# EasyEDA Pro project ProPrj_辉光管时钟V2.0_2025-10-09.epro, schematic 电源+控制部分

## Sheets
1 控制: Board Name: 电源+控制部分; Create Date: 2024-09-08; Page Name: 控制; Project Name: 辉光管时钟V2.0; Schematic Name: 电源+控制部分; Update Date: 2024-09-17
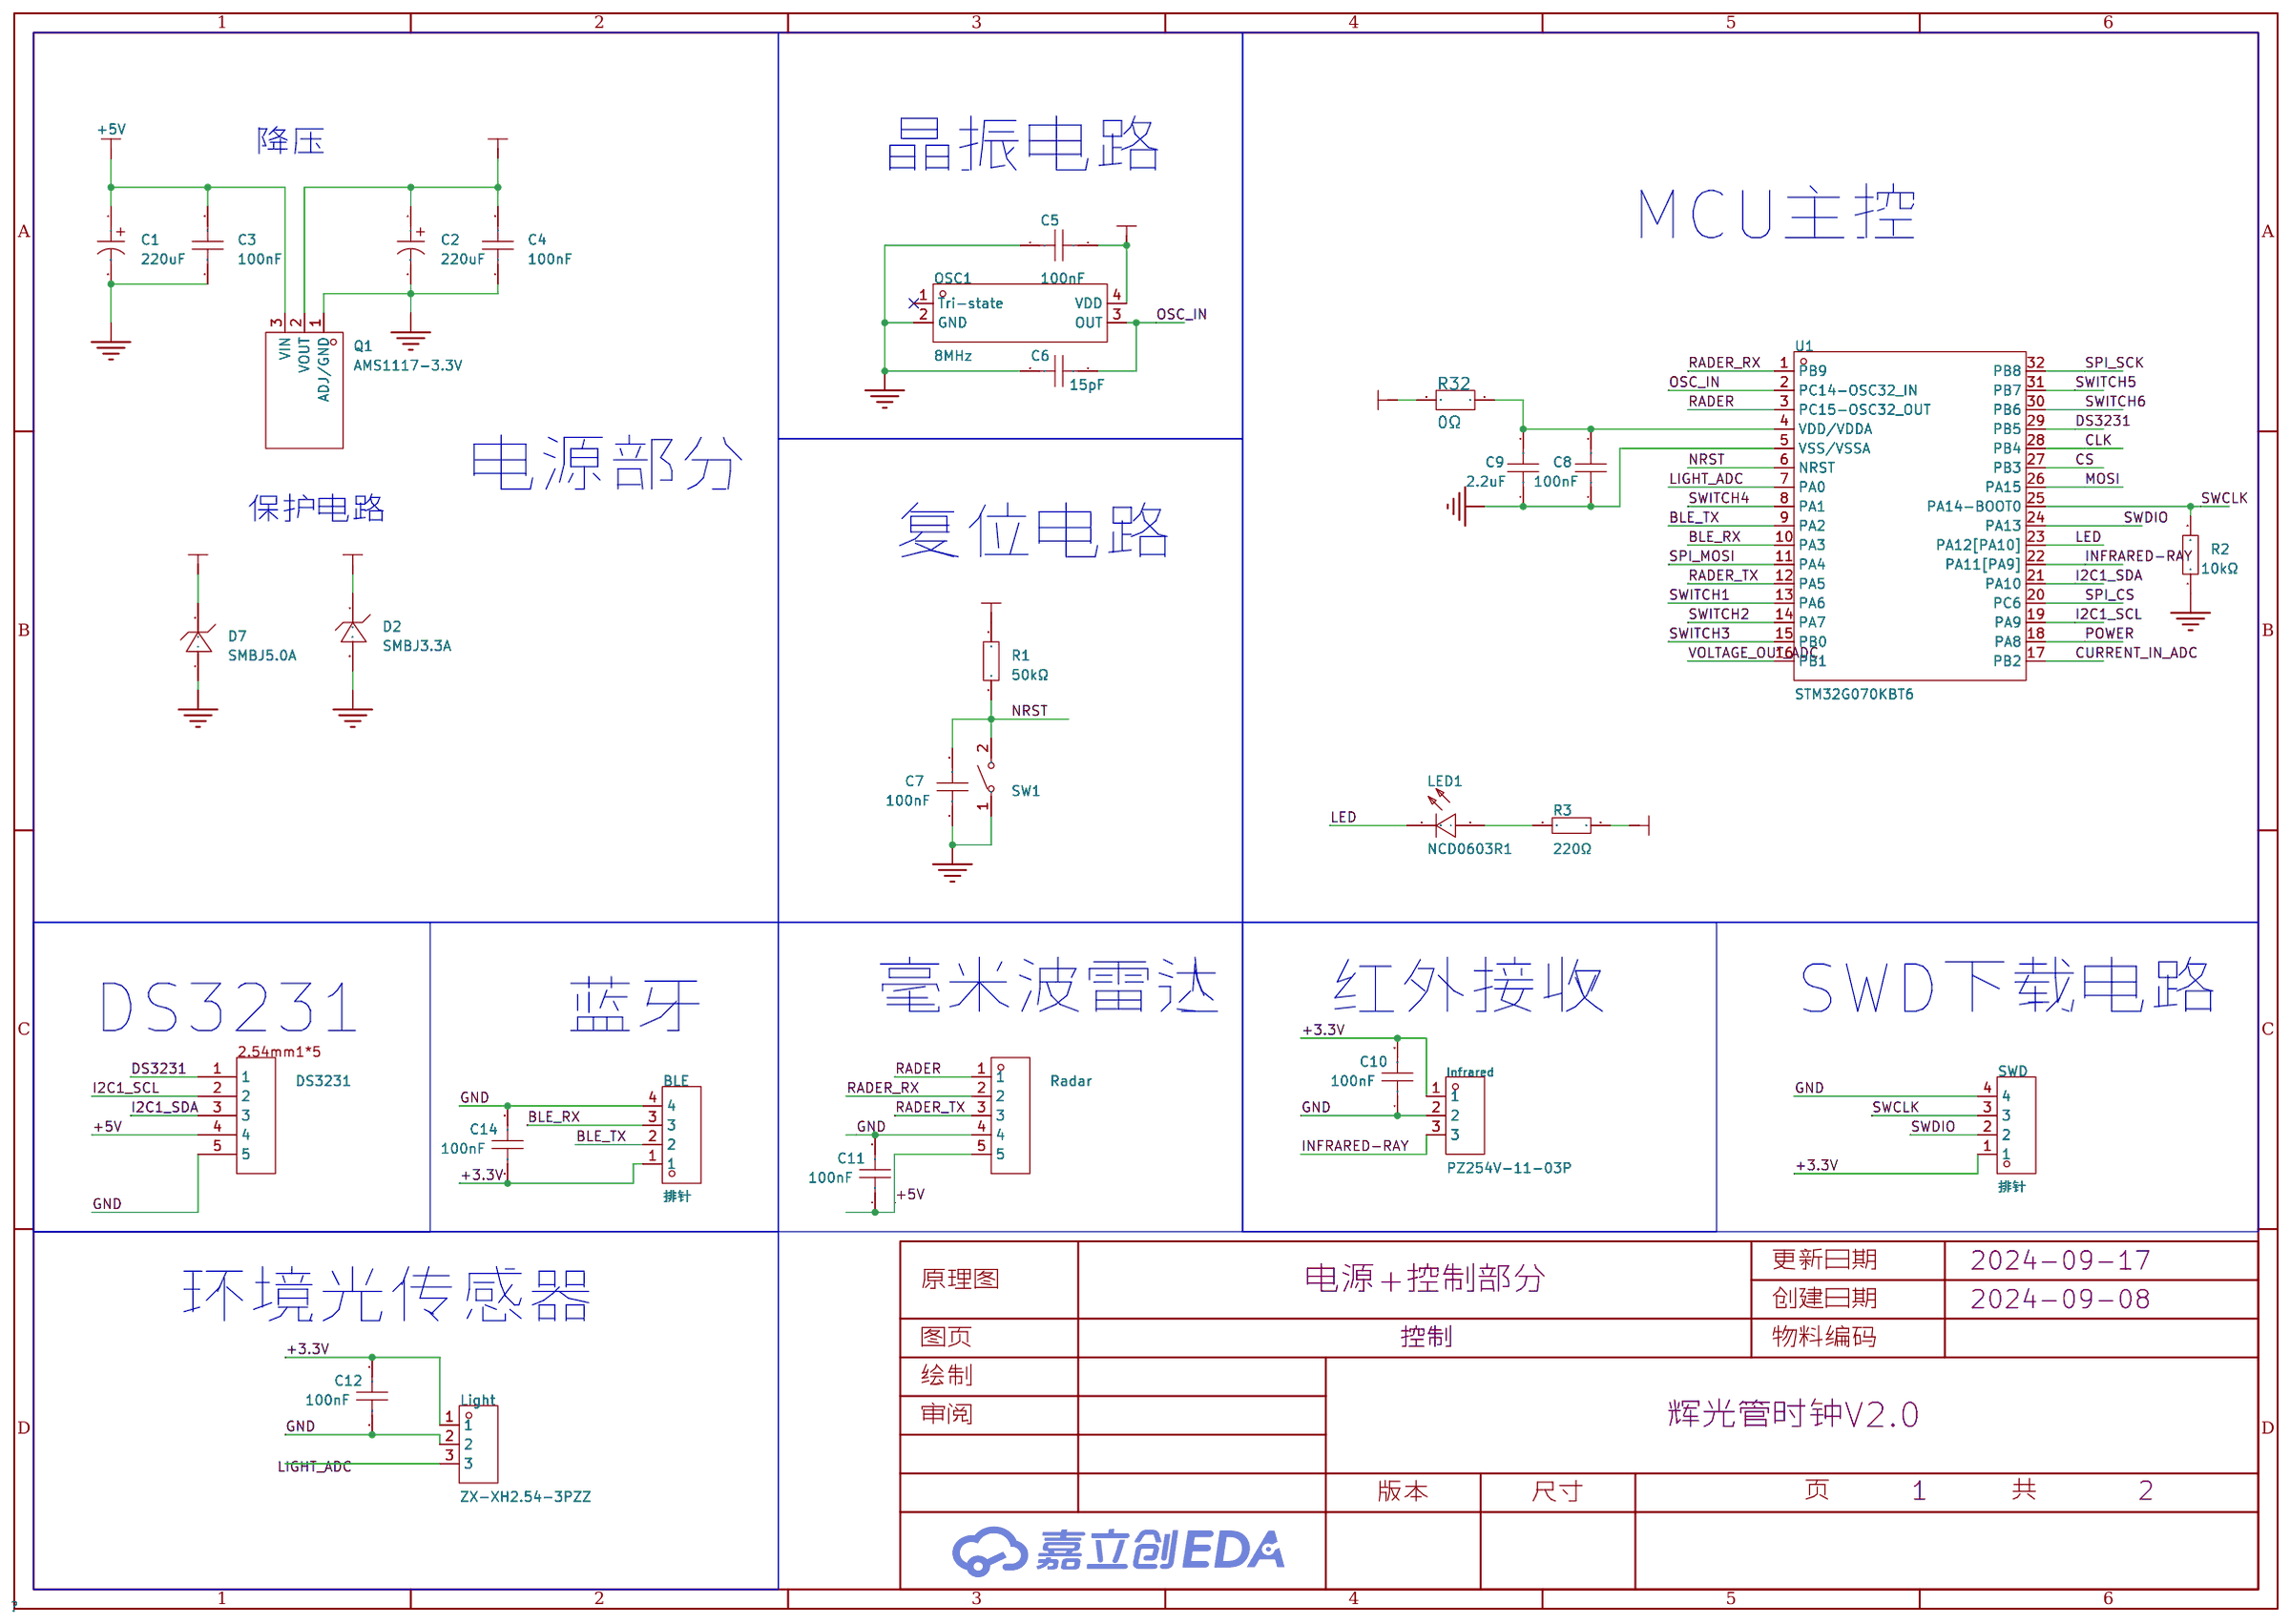
[diagram p1: 控制]
2 电源: Page Name: 电源; Update Date: 2024-09-19; Company: 嘉立创EDA; Page Size: A3; Version: V1.0
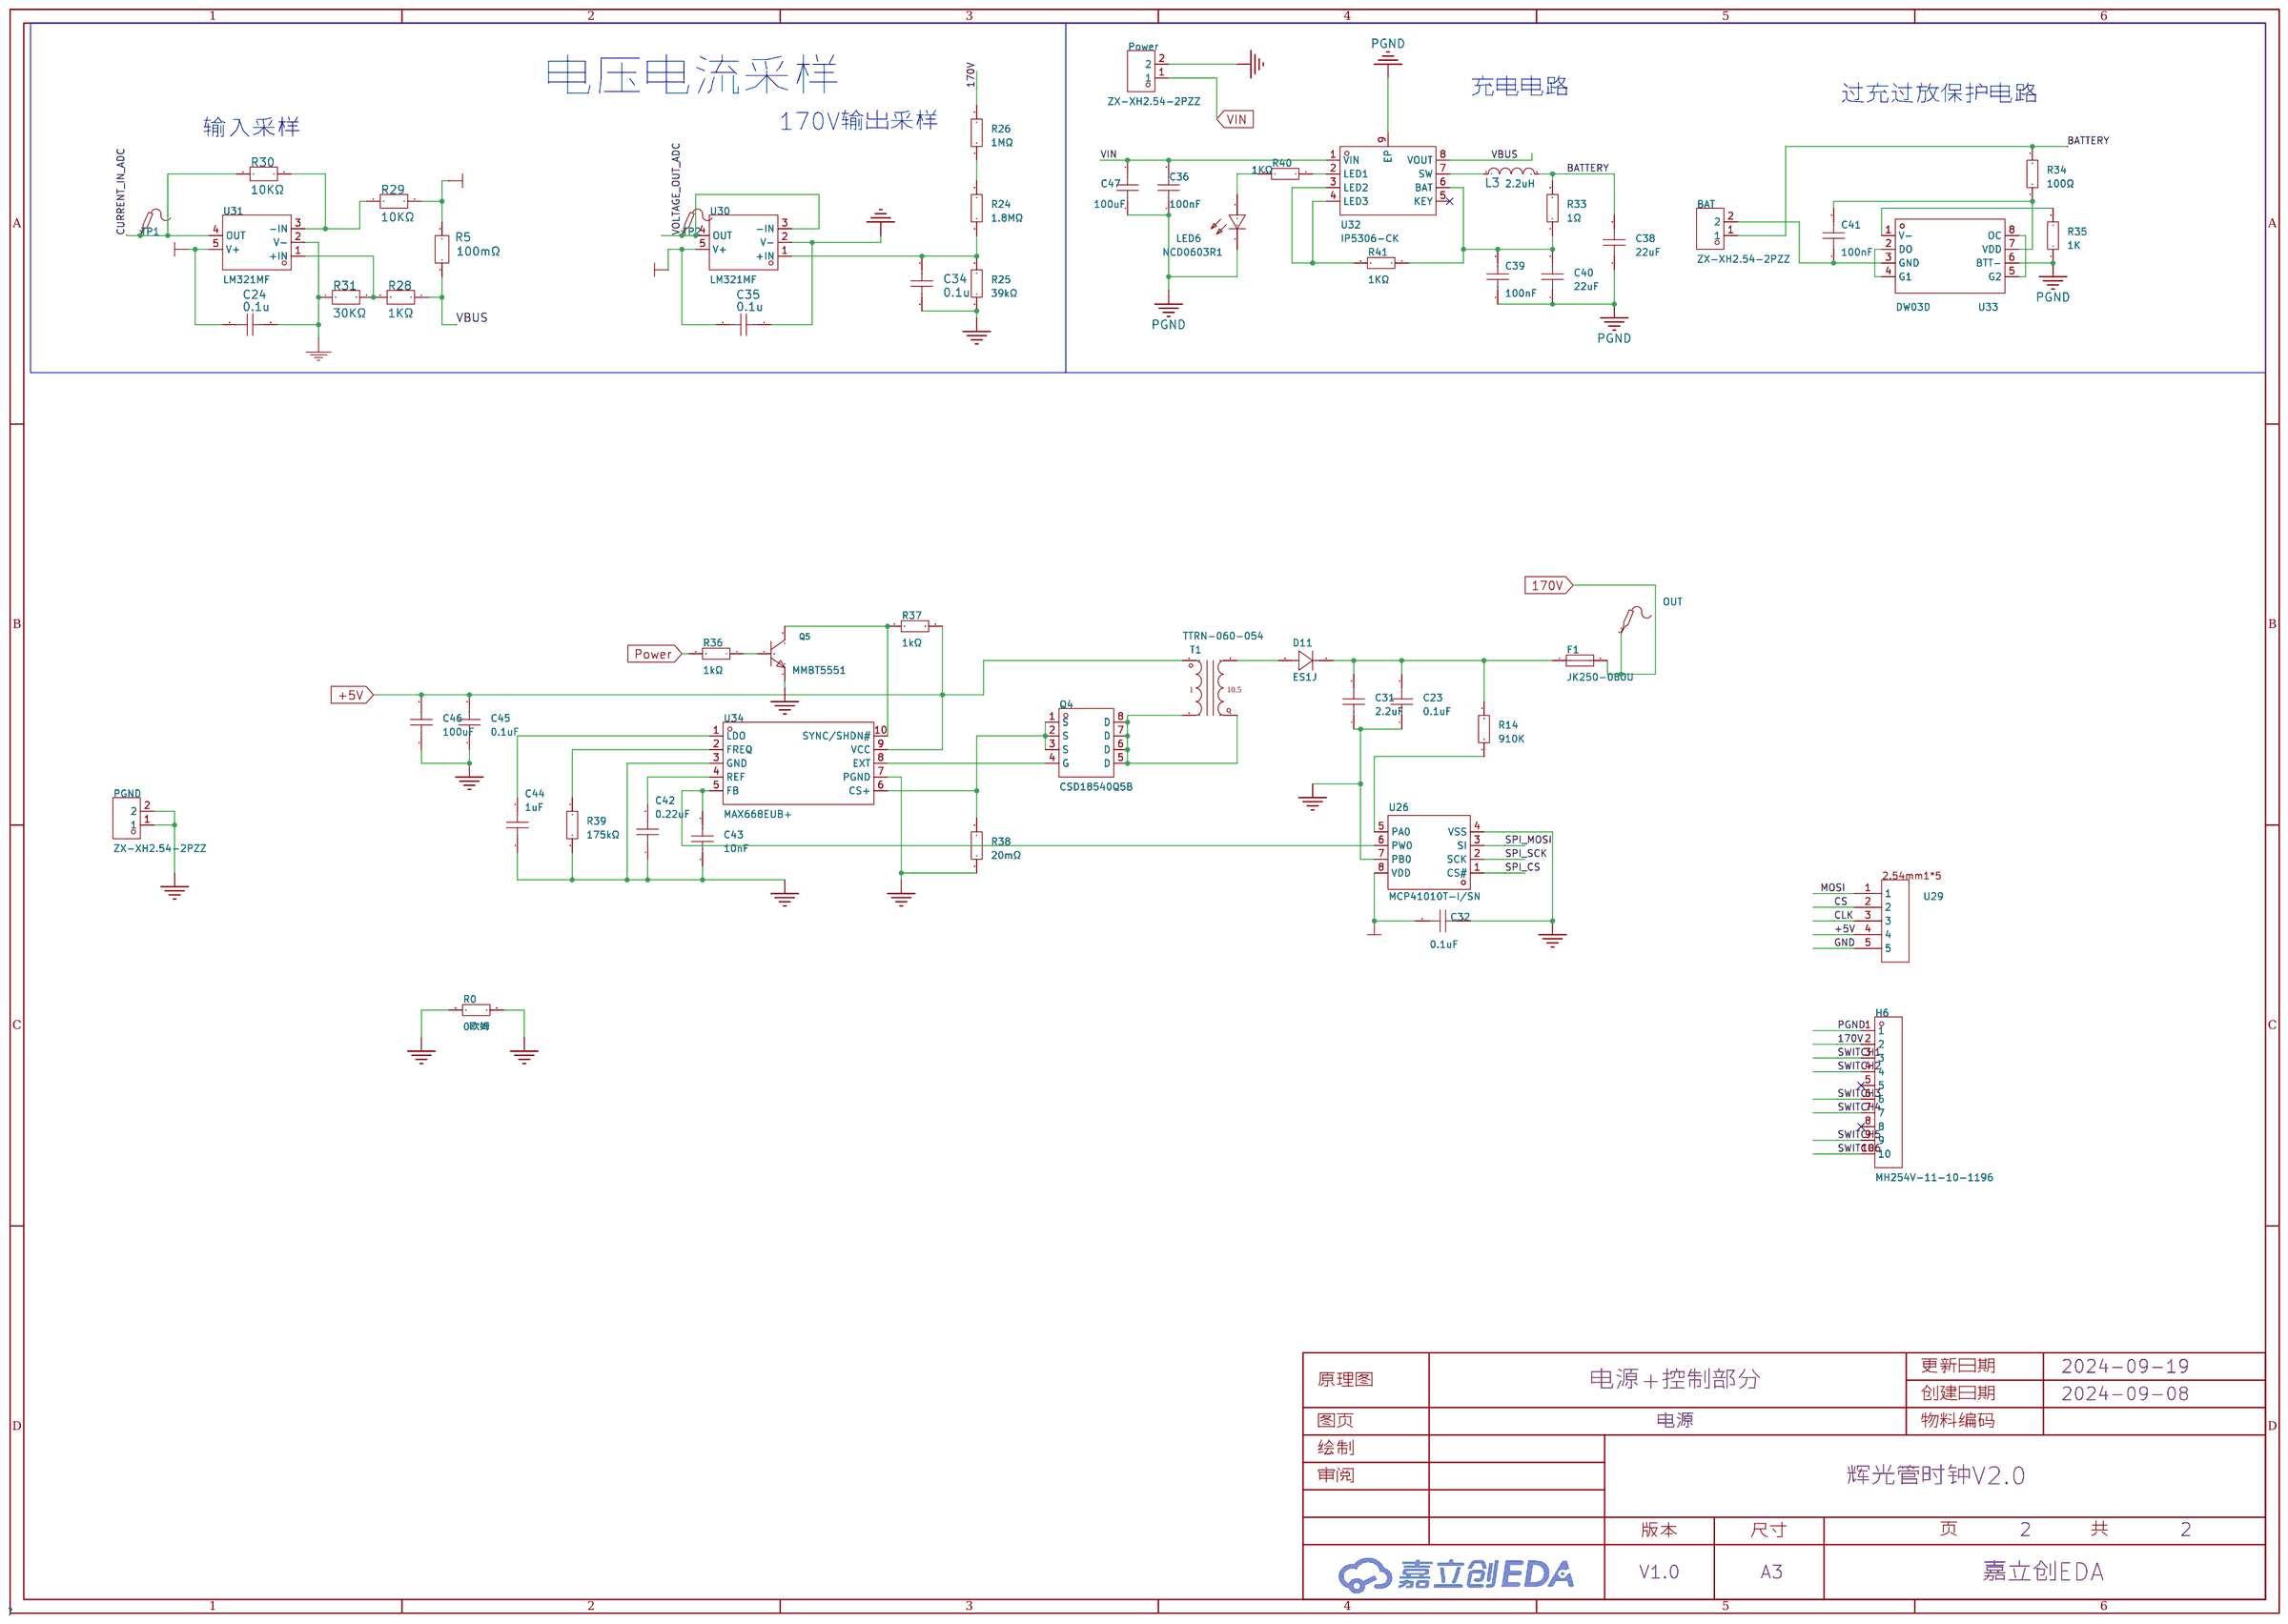
[diagram p2: 电源]

## Parts
sheet 控制
BLE  排针  [SIP-2.54MM-4P-CJT-H8.54]
C1  220uF  [CAP-SMD_BD6.3-L6.6-W6.6-FD]
C2  220uF  [CAP-SMD_BD6.3-L6.6-W6.6-FD]
C3  100nF  [C0603]
C4  100nF  [C0603]
C5  100nF  [C0603]
C6  15pF  [C0603]
C7  100nF  [C0603]
C8  100nF  [C0603]
C9  2.2uF  [C0603]
C10  100nF  [C0603]
C11  100nF  [C0603]
C12  100nF  [C0603]
C14  100nF  [C0603]
D2  SMBJ3.3A  [SMB_L4.6-W3.6-LS5.3-RD]
D7  SMBJ5.0A  [SMB_L4.4-W3.6-LS5.3-RD]
DS3231  -  [2.54mm1*5]
Infrared  PZ254V-11-03P  [HDR-TH_3P-P2.54-V-M]
LED1  NCD0603R1  [LED0603-RD_RED]
Light  ZX-XH2.54-3PZZ  [CONN-TH_3P-P2.54_2501S-3P]
OSC1  8MHz  [OSC-SMD_4P-L3.2-W2.5-BL-1]
Q1  AMS1117-3.3V  [SOT-89-3_L4.5-W2.5-P1.50-LS4.2-BR]
R1  50kΩ  [r0603]
R2  10kΩ  [r0603]
R3  220Ω  [r0603]
R32  0Ω  [R0603]
Radar  FH1.27-01-5PZD  [HDR-TH_5P-P1.27-V-M]
SW1  TS-1088R-02026  [SW-SMD_L3.9-W3.0-P4.45]
SWD  排针  [SIP-2.54MM-4P-CJT-H8.54]
U1  STM32G070KBT6  [LQFP-32_L7.0-W7.0-P0.80-LS9.0-BL]
sheet 电源
BAT  ZX-XH2.54-2PZZ  [CONN-TH_2P-P2.50_HX25003-2A]
C23  0.1uF  [c1206]
C24  0.1u  [C0603]
C31  2.2uF  [c1210]
C32  0.1uF  [c0603]
C34  0.1u  [C0603]
C35  0.1u  [C0603]
C36  100nF  [C0603]
C38  22uF  [c1206]
C39  100nF  [C0603]
C40  22uF  [c1206]
C41  100nF  [C0603]
C42  0.22uF  [c0603]
C43  10nF  [c0603]
C44  1uF  [c0603]
C45  0.1uF  [c0603]
C46  100uF  [c1206]
C47  100uF  [c1206]
D11  ES1J  [sod-123_l2.7-w1.6-ls3.6-rd]
F1  JK250-080U  [FUSE-TH_L5.8-W3.8-P5.10-D0.8]
H6  MH254V-11-10-1196  [HDR-TH_10P-P2.54-V-M]
L3  2.2uH  [IND-SMD_L7.0-W6.6]
LED6  NCD0603R1  [LED0603-RD_RED]
OUT  -  [Test-Point-0.5mm]
PGND  ZX-XH2.54-2PZZ  [CONN-TH_2P-P2.50_HX25003-2A]
Power  ZX-XH2.54-2PZZ  [CONN-TH_2P-P2.50_HX25003-2A]
Q4  CSD18540Q5B  [VSON-CLIP-8_L5.0-W6.0-P1.27-BL]
Q5  MMBT5551  [SOT-23-3_L2.9-W1.3-P1.90-LS2.4-BR]
R0  0欧姆  [R0603]
R5  100mΩ  [R0805]
R14  910K  [r0603]
R24  1.8MΩ  [r0603]
R25  39kΩ  [r0603]
R26  1MΩ  [r0603]
R28  1KΩ  [R0603]
R29  10KΩ  [R0603]
R30  10KΩ  [R0603]
R31  30KΩ  [R0603]
R33  1Ω  [R0603]
R34  100Ω  [R0603]
R35  1K  [R0603]
R36  1kΩ  [r0603]
R37  1kΩ  [r0603]
R38  20mΩ  [R0805]
R39  175kΩ  [r0603]
R40  1KΩ  [R0603]
R41  1KΩ  [R0603]
T1  TTRN-060-054  [TTRN-060-054]
TP1  -  [Test-Point-0.5mm]
TP2  -  [Test-Point-0.5mm]
U26  MCP41010T-I/SN  [SOIC-8_L4.9-W3.9-P1.27-LS6.0-BL]
U29  -  [2.54mm1*5]
U30  LM321MF  [SOT-23-5_L2.9-W1.6-P0.95-LS2.8-BL]
U31  LM321MF  [SOT-23-5_L2.9-W1.6-P0.95-LS2.8-BL]
U32  IP5306-CK  [SOP-8_L4.9-W3.9-P1.27-LS6.0-BL-EP2.1]
U33  DW03D  [TSSOP-8_L4.4-W3.0-P0.65-LS6.4-BL]
U34  MAX668EUB+  [UMAX-10_L3.0-W3.0-P0.50-LS4.9-BL]

## Library data of the parts
BLE SWD = 排针
C1 C2 = RVT220UF10V67RV0037: 容值:220uF;精度:±20%;额定电压:10V;纹波电流:69mA@120Hz;等效串联电阻:-;; LCSC Part Name: 220uF ±20% 10V; Supplier Part: C2833309; Manufacturer: KNSCHA(科尼盛); Supplier Footprint: SMD,D6.3xL5.4mm; JLCPCB Part Class: Extended Part; Datasheet: https://atta.szlcsc.com/upload/public/pdf/source/20210521/C2833309_008BCE4BC4FC60DA08096FEE6338ABBD.pdf; Supplier: LCSC; Tolerance: ±20%; Rated Voltage: 10V; Ripple Current: 69mA@120Hz; φD: 6.3mm; L: 5.4mm; Lifetime @ Temp: 2000hrs@105℃; Operating Temperature: -55℃~+105℃
C3-C12 C14 = CC0603KRX7R9BB104: 容值:100nF;精度:±10%;额定电压:50V;材质(温度系数):X7R;; LCSC Part Name: 100nF ±10% 50V; Supplier Part: C14663; Manufacturer: YAGEO(国巨); Supplier Footprint: 0603; JLCPCB Part Class: Basic Part; Datasheet: https://atta.szlcsc.com/upload/public/pdf/source/20180910/C282072_33301C7F631E79921B82A8DAC6BCC5B3.pdf; Supplier: LCSC; Tolerance: ±10%; Voltage Rated: 50V; Temperature Coefficient: X7R
D2 = SMBJ3.3A_C362089: 反向截止电压(Vrwm):3.3V;击穿电压:4.1V;最大钳位电压:7.3V;; LCSC Part Name: 单向TVS 3.3V截止 600W峰值脉冲功率; Supplier Part: C362089; Manufacturer: JKSEMI(金开盛); Supplier Footprint: SMB(DO-214AA); JLCPCB Part Class: Extended Part; Datasheet: https://atta.szlcsc.com/upload/public/pdf/source/20200731/C362089_3B984BF84356FE4A5051ADB3F5B1E766.pdf; Supplier: LCSC; Unidirectional Channels: 1; Bidirectional Channels: 0; Reverse Stand-Off Voltage (Vrwm): 3.3V; Breakdown Voltage: 4.1V; Maximum Clamping Voltage: 7.3V; Peak Pulse Power Dissipation (Ppp)@10/1000us: 600W
D7 = SMBJ5.0A_C726811: 极性：单向 反向截止电压(Vrwm)：5V 击穿电压：6.4V 最大钳位电压：9.2V; Supplier Part: C726811; Manufacturer: TWGMC(台湾迪嘉); Supplier Footprint: SMB; JLCPCB Part Class: Extended Part; Datasheet: https://atta.szlcsc.com/upload/public/pdf/source/20200901/C726811_07201DC3516E92FF13903A0BAE18F725.pdf; Supplier: LCSC
DS3231 U29 = 2.54mm1*5
Infrared = PZ254V-11-03P: 排数:单排;总PIN位数:3;间距:2.54mm;插针结构:1x3P;行距:-;安装类型:直插;圆针/方针:方针;额定电流:3A;额定电压:250V;配合针长度:6mm;塑高:2.5mm;端接针长度:3mm;工作温度范围:-40℃~+105℃;颜色:黑色;; LCSC Part Name: 2.54mm 1x3P 直插 方针; Supplier Part: C2937625; Manufacturer: XFCN(兴飞); Supplier Footprint: 直插,P=2.54mm; JLCPCB Part Class: Extended Part; Datasheet: 2022-07-12/581362A/62b9d00620994b3696be7eb4af85ad72/双排排针和单排排针.pdf; Supplier: LCSC; Number of Rows: 单排; Number of Pins: 3; Pitch: 2.54mm; Pin Structure: 1x3P; Mounting Type: 直插; Circluar Pins/Square Pins: 方针; Current Rating (Max): 3A; Voltage Rating (Max): 250V; Length of Mating Pin: 6mm; Insulation Height: 2.5mm; Length of End Connection Pin: 3mm; Operating Temperature Range: -40℃~+105℃; Color: 黑色
LED1 LED6 = NCD0603R1_C84263: 发光颜色:红色;功率:65mW;透镜颜色:无色透明;主波长:615nm~630nm;发光强度:80mcd~220mcd;发光角度:130°;工作温度:-30℃~+85℃;; LCSC Part Name: 红灯 0603红灯   正贴; Supplier Part: C84263; Manufacturer: 国星光电; Supplier Footprint: 0603; JLCPCB Part Class: 扩展库; Datasheet: https://atta.szlcsc.com/upload/public/pdf/source/20200820/C84263_DABC6A75E58F576973B407FDBA283D60.pdf; Supplier: LCSC; Emitted Color: 红色; Forward Voltage (VF): 1.6V~2.6V; Forward Current: 20mA; Power Dissipation: 65mW; Lens Color: 无色透明; Dominant Wavelength: 615nm~630nm; Luminous Intensity: 80mcd~220mcd; Viewing Angle: 130°; Operating Temperature: -30℃~+85℃
Light = ZX-XH2.54-3PZZ: 插针结构:1x3P;间距:2.54mm;安装方式:直插;参考系列:XH;总PIN数:3P;排数:1;每排PIN数:3;行距:-;额定电流:3A;触头材质:黄铜;触头镀层:锡;工作温度范围:-25℃~+85℃;; Supplier Part: C7429633; Manufacturer: Megastar(兆星); Supplier Footprint: 插件,P=2.54mm; JLCPCB Part Class: 扩展库; Datasheet: https://atta.szlcsc.com/upload/public/pdf/source/20230619/AE17037A2CFDBE8D9CBA775D61AD0A84.pdf; Supplier: LCSC; Pins Structure: 1x3P; Pitch: 2.54mm; Mounting Style: 直插; Reference Series: XH; Number of Pins: 3P; Number of Rows: 1; Number of PINs Per Row: 3; Current Rating (Max): 3A; Contact Material: 黄铜; Contact Plating: 锡; Operating Temperature Range: -25℃~+85℃
OSC1 = OT2EL4C4JI-111OLP-8M: 频率:8MHz;工作电压:1.8V~3.3V;; LCSC Part Name: 8MHZ?1.8V-3.3V?±10PPM YSO110TR; Supplier Part: C5189450; Manufacturer: YXC(扬兴晶振); Supplier Footprint: SMD3225-4P; JLCPCB Part Class: 扩展库; Datasheet: https://atta.szlcsc.com/upload/public/pdf/source/20221009/1148DEA51132416CC556CBB25766F9C8.pdf; Supplier: LCSC; Supply Voltage: 1.8V~3.3V; Operating Temperature: -40℃~+85℃
Q1 = AMS1117-3.3V_C5120796: 输出类型:固定;最大输入电压:18V;输出电压:3.3V;最大输出电流:1A;输出极性:正极;; LCSC Part Name: 输入18V 输出3.3V 1A; Supplier Part: C5120796; Manufacturer: MSKSEMI(美森科); Supplier Footprint: SOT-89; JLCPCB Part Class: Extended Part; Datasheet: https://atta.szlcsc.com/upload/public/pdf/source/20231123/6117526697EB8BF6175FDEEBA0877266.pdf; Supplier: LCSC; Output Type: 固定; Maximum Input Voltage: 18V; Output Voltage: 3.3V; MAX Output Current: 1A; Dropout Voltage: 1.4V@(1A); standby current: 12mA; Operating Temperature: 0℃~+125℃; Output Polarity: 正极; Number of Outputs: 1
R1-R3 R14 R24-R26 R36 R37 R39 = 0805W8F1002T5E_C17414: 电阻类型:厚膜电阻;阻值:10kΩ;精度:±1%;功率:125mW;; LCSC Part Name: 10kΩ ±1% 125mW; Supplier Part: C17414; Manufacturer: UNI-ROYAL(厚声); Manufacturer Part: 0805W8F1002T5E; Supplier Footprint: 0805; JLCPCB Part Class: Basic Part; Datasheet: https://atta.szlcsc.com/upload/public/pdf/source/20200306/C422600_1E6D84923E4A46A82E41ADD87F860B5C.pdf; Supplier: LCSC; Type: 厚膜电阻; Tolerance: ±1%; Power(Watts): 125mW; Temperature Coefficient: ±100ppm/℃; Overload Voltage (Max): 150V; Operating Temperature Range: -55℃~+155℃
R5 R28-R32 = 5mΩ
Radar = FH1.27-01-5PZD: 插针结构:1x5P;间距:1.27mm;安装方式:直插;总PIN数:5P;排数:1;每排PIN数:5;额定电流:1A;触头材质:磷青铜;工作温度范围:-40℃~+105℃;; LCSC Part Name: 1x5P 间距:1.27mm 直插; Supplier Part: C7500807; Manufacturer: XUNPU(讯普); Supplier Footprint: 插件,P=1.27mm; Datasheet: https://atta.szlcsc.com/upload/public/pdf/source/20230809/1C0A5A5FA3077CCA4BCC60F929FB990D.pdf; Supplier: LCSC; Pins Structure: 1x5P; Pitch: 1.27mm; Mounting Style: 直插; Number of Pins: 5P; Number of Rows: 1; Number of PINs Per Row: 5; Current Rating (Max): 1A; Contact Material: 磷青铜; Operating Temperature Range: -40℃~+105℃
SW1 = TS-1088R-02026: 电路结构:单刀单掷;按钮形状:圆形按钮;开关长度:3.9mm;开关宽度:2.93mm;开关高度:2mm;触点电流:50mA;额定电压(DC):12V;安装方式:立贴;带灯:-;机械寿命:-;; LCSC Part Name: 3.9*2.93*2mm 立贴 轻触开关; Supplier Part: C455280; Manufacturer: XUNPU(讯普); Supplier Footprint: SMD,3x4mm; JLCPCB Part Class: 扩展库; Datasheet: https://atta.szlcsc.com/upload/public/pdf/source/20191118/C455281_EC5379764BC1462550DF64BBBFEA9579.pdf; Supplier: LCSC; Circuit: 单刀单掷; Actuator Style: 圆形按钮; Switch Length: 3.9mm; Switch Width: 2.93mm; Switch Height: 2mm; Contact Current: 50mA; Voltage Rating (DC): 12V; Mounting Style: 立贴
U1 = STM32G070KBT6: CPU内核:ARM Cortex-M0;CPU最大主频:64MHz;工作电压范围:2V~3.6V;程序存储容量:128KB;程序存储器类型:FLASH;RAM总容量:36KB;GPIO端口数量:29;; Supplier Part: C529339; Manufacturer: ST(意法半导体); Supplier Footprint: LQFP-32(7x7); JLCPCB Part Class: 扩展库; Datasheet: https://atta.szlcsc.com/upload/public/pdf/source/20200511/C529338_48C8B1D333BC51E6E9668757AAD26A84.pdf; Supplier: LCSC; CPU Core: ARM Cortex-M0; CPU Maximum Speed: 64MHz; Operating Voltage Range: 2V~3.6V; Program Storage Size: 128KB; Program Memory Type: FLASH; RAM Size: 36KB; GPIO Ports Number: 29; ADC (Bit): 12bit; Peripheral/Function: DMA；PWM; Internal Oscillator: 有; Operating Temperature Range: -40℃~+85℃
BAT PGND Power = ZX-XH2.54-2PZZ: 插针结构:1x2P;间距:2.54mm;安装方式:直插;参考系列:XH;总PIN数:2P;排数:1;每排PIN数:2;行距:-;额定电流:3A;触头材质:黄铜;触头镀层:锡;工作温度范围:-25℃~+85℃;; Supplier Part: C7429632; Manufacturer: Megastar(兆星); Supplier Footprint: 插件,P=2.54mm; JLCPCB Part Class: Extended Part; Datasheet: https://atta.szlcsc.com/upload/public/pdf/source/20230619/19BA6947230AA44A04D3EDD65E618FD0.pdf; Supplier: LCSC; Pins Structure: 1x2P; Pitch: 2.54mm; Mounting Style: 直插; Reference Series: XH; Number of Pins: 2P; Number of Rows: 1; Number of PINs Per Row: 2; Current Rating (Max): 3A; Contact Material: 黄铜; Contact Plating: 锡; Operating Temperature Range: -25℃~+85℃
C23 C32 C42-C47 = CC0805KRX7R9BB104: 容值:100nF;精度:±10%;额定电压:50V;材质(温度系数):X7R;; LCSC Part Name: 100nF ±10% 50V; Supplier Part: C49678; Manufacturer: YAGEO(国巨); Supplier Footprint: 0805; JLCPCB Part Class: Basic Part; Datasheet: https://atta.szlcsc.com/upload/public/pdf/source/20151026/1457707504898.pdf; Supplier: LCSC; Tolerance: ±10%; Voltage Rated: 50V; Temperature Coefficient: X7R
C24 C34 C35 = 0.1u
C31 = CC0805KRX7R9BB104: 容值:100nF;精度:±10%;额定电压:50V;材质(温度系数):X7R;; LCSC Part Name: 100nF ±10% 50V; Supplier Part: C49678; Manufacturer: YAGEO(国巨); Supplier Footprint: 0805; JLCPCB Part Class: Basic Part; Datasheet: https://atta.szlcsc.com/upload/public/pdf/source/20151026/1457707504898.pdf; Supplier: LCSC; Tolerance: ±10%; Voltage Rated: 200V; Temperature Coefficient: X7R
C36 C39 C41 = CAP_0603: Supplier Footprint: 0603
C38 C40 = CAP_1206: Supplier Footprint: 1206
D11 = ES1J_C691230: 正向压降(Vf):1.3V @ 1A;平均整流电流(Io):1A;直流反向耐压(Vr):600V;二极管配置:独立式;工作结温(Tj):-55℃~+150℃;工作结温(Tj):-55℃~+150℃;反向电流(Ir):5uA @ 600V;反向恢复时间(trr):35ns;; Supplier Part: C691230; Manufacturer: DIODES(美台); Supplier Footprint: SMA; JLCPCB Part Class: Extended Part; Datasheet: https://atta.szlcsc.com/upload/public/pdf/source/20200628/C691230_6EC9ACEA5CE84292BBF501D48DE20532.pdf; Supplier: LCSC
F1 = JK250-080U: 最大电压:250V;最大电流:3A;保持电流:80mA;跳闸电流:160mA;; LCSC Part Name: 250V 80mA 插件自恢复; Supplier Part: C369127; Manufacturer: JK(金科); Supplier Footprint: 插件; JLCPCB Part Class: Extended Part; Datasheet: https://atta.szlcsc.com/upload/public/pdf/source/20190402/C369127_E7230E1328F96C53474DAC88A9C5A944.pdf; Supplier: LCSC; Operating Voltage (Max): 250V; Current Rating (Max): 3A; Hold Current: 80mA; Trip Current: 160mA; Maximum Time to Trip: 500ms
H6 = MH254V-11-10-1196: LCSC Part Name: 圆孔排针2.54mm 1x10P 直插 镀金1U L=11.96mm 常规型; Supplier Part: C5184055; Manufacturer: XFCN(兴飞); Supplier Footprint: 插件,P=2.54mm; JLCPCB Part Class: 扩展库; Datasheet: https://atta.szlcsc.com/upload/public/pdf/source/20220929/9F034EF7D5273C93A87A714F13A4BC8E.pdf; Supplier: LCSC
L3 = APH0630T1R0M: 类型:一体成型电感;电感值:1uH;精度:±20%;额定电流:10.73A;饱和电流(Isat):12.45A;; LCSC Part Name: 1uH ±20% 12.45A; Supplier Part: C5349700; Manufacturer: APV(爱普微); Supplier Footprint: L0630; JLCPCB Part Class: Extended Part; Datasheet: https://atta.szlcsc.com/upload/public/pdf/source/20230920/8DF4F91CA8787177DE496A10F73889DA.pdf; Supplier: LCSC; Type: 一体成型电感; Tolerance: ±20%; Rated Current: 10.73A; Saturation Current (Isat): 12.45A; DC Resistance (DCR): 7.4mΩ
OUT TP1 TP2 = Test-Point: Test Point 测试点
Q4 = CSD18540Q5B: 类型:1个N沟道;漏源电压(Vdss):60V;连续漏极电流(Id):100A;功率(Pd):3.1W；195W;导通电阻(RDS(on)@Vgs,Id):2.2mΩ@10V,28A;阈值电压(Vgs(th)@Id):2.3V@250uA;; LCSC Part Name: 1个N沟道 耐压:60V 电流:100A; Supplier Part: C86513; Manufacturer: TI(德州仪器); Supplier Footprint: VSON-8(5x6); JLCPCB Part Class: 扩展库; Datasheet: https://www.ti.com/cn/lit/gpn/csd18540q5b; Supplier: LCSC; Type: 1个N沟道; Drain Source Voltage (Vdss): 60V; Continuous Drain Current (Id): 100A; Power Dissipation (Pd): 3.1W；195W; Drain Source On Resistance (RDS(on)@Vgs,Id): 2.2mΩ@10V,28A; Gate Threshold Voltage (Vgs(th)@Id): 2.3V@250uA; Total Gate Charge (Qg@Vgs): 53nC@10V; Input Capacitance (Ciss@Vds): 4.23nF@30V; Operating Temperature: -55℃~+150℃@(Tj)
Q5 = MMBT5551_C2145: 晶体管类型:NPN;集射极击穿电压(Vceo):160V;集电极电流(Ic):600mA;功率(Pd):300mW;直流电流增益(hFE@Ic,Vce):200@10mA,5V;; LCSC Part Name: NPN 160V 600mA G1 H档200-300; Supplier Part: C2145; Manufacturer: CJ(江苏长电/长晶); Supplier Footprint: SOT-23; JLCPCB Part Class: Basic Part; Datasheet: https://atta.szlcsc.com/upload/public/pdf/source/20140809/1457707209203.pdf; Supplier: LCSC; Transistor Type: NPN; Collector-Emitter Breakdown Voltage (Vceo): 160V; Collector Current (Ic): 600mA; Power Dissipation (Pd): 300mW; Collector Cut-Off Current (Icbo): 50nA; Collector-Emitter Saturation Voltage (VCE(sat)@Ic,Ib): 200mV@50mA,5mA; DC Current Gain (hFE@Ic,Vce): 200@10mA,5V; Transition Frequency (fT): 100MHz; Operating Temperature: +150℃@(Tj)
R0 = Res_0603: Supplier Footprint: 0603
R33-R35 R40 R41 = Res_0805: Supplier Footprint: 0805
R38 = RL10FTNR160: 阻值:160mΩ;精度:±1%;; LCSC Part Name: 160mΩ ±1%; Supplier Part: C5138985; Manufacturer: 大毅科技; Supplier Footprint: 0805; JLCPCB Part Class: Extended Part; Datasheet: https://atta.szlcsc.com/upload/public/pdf/source/20220824/9B3755BD17A966410CFA156DB04E8A1C.pdf; Supplier: LCSC; Tolerance: ±1%; Type: 厚膜电阻; Power(Watts): 125mW; Temperature Coefficient: ±100ppm/℃; Overload Voltage (Max): 150V; Operating Temperature Range: -55℃~+155℃
T1 = TTRN-060-054: Supplier: TOKOT COIL; _: 3
U26 = MCP41010T-I/SN: 供电电压:2.7V~5.5V;电阻值(欧姆):10kΩ;精度:±20%;接口类型:SPI;; Supplier Part: C136395; Manufacturer: MICROCHIP(美国微芯); Supplier Footprint: SOP-8; JLCPCB Part Class: Extended Part; Datasheet: https://atta.szlcsc.com/upload/public/pdf/source/20220205/C2666606_C5E8E7A5F3891B321C1555D845654E7B.pdf; Supplier: LCSC; Supply Voltage: 2.7V~5.5V; Resistance Value (Ohms): 10kΩ; Number of Taps: 256; Temperature Coefficient (Typ): 800ppm/℃; Precision: ±20%; Number of Channels: 1; Interface Type: SPI; Operating Temperature: -40℃~+85℃
U30 U31 = LM321MF: 放大器数:-;; Supplier Part: C668208; Manufacturer: UMW(友台半导体); Supplier Footprint: SOT-23-5L; JLCPCB Part Class: 扩展库; Datasheet: https://atta.szlcsc.com/upload/public/pdf/source/20231109/E49D74FC1833823153F9A4939CD7E005.pdf; Supplier: LCSC
U32 = IP5306-CK: Supplier Part: C2914335; Supplier Footprint: ESOP-8_L4.9-W3.9-P1.27-LS6.0-B; JLCPCB Part Class: Extended Part; Supplier: LCSC
U33 = DW03D: 二合一锂电池保护芯片; Supplier Part: C82200; Manufacturer: FM(富满); Supplier Footprint: TSSOP-8(3x4.4x0.65); JLCPCB Part Class: Extended Part; Datasheet: https://atta.szlcsc.com/upload/public/pdf/source/20170814/C82200_1502678439162886029.pdf; Supplier: LCSC
U34 = MAX668EUB+: 电源电压:3V~28V;开关频率:100kHz~500kHz;; Supplier Part: C1530054; Manufacturer: ADI(亚德诺)/MAXIM(美信); Supplier Footprint: MSOP-10; JLCPCB Part Class: 扩展库; Datasheet: https://atta.szlcsc.com/upload/public/pdf/source/20171204/C143564_15123772685461162718.pdf; Supplier: LCSC; Supply Voltage: 3V~28V; Switching Frequency: 100kHz~500kHz; Duty Cycle: 90%; Topology: 反激式；SEPIC；升压式; Operating Temperature: -40℃~+85℃@(TA)

## Nets
170V: F1.2 H6.2 OUT.1 R26.2
+3.3V: BLE.1 C2.1 C4.2 C5.1 C10.2 C12.2 C14.1 D2.1 Infrared.1 Light.1 OSC1.4(VDD) Q1.2(VOUT) R1.2 R3.1 R32.2 SWD.1
+5V: C1.1 C3.2 C11.1 C24.2 C32.2 C35.2 C45.2 C46.2 DS3231.4 Q1.3(VIN) R5.2 R29.1 R37.2 Radar.5 T1.1 U26.8(VDD) U29.4 U30.5(V+) U31.5(V+) U34.9(VCC)
GND: BLE.4 C2.2 C4.1 C5.2 C6.2 C7.1 C8.1 C9.1 C10.1 C11.2 C12.1 C14.2 C24.1 C32.1 C35.1 C42.1 C43.1 C44.1 D2.2 DS3231.5 Infrared.2 Light.2 OSC1.2(GND) Q1.1(ADJ/GND) R0.2 R2.1 R31.1 R39.2 Radar.4 SW1.1 SWD.4 U1.5(VSS/VSSA) U26.4(VSS) U29.5 U30.2(V-) U31.2(V-) U34.3(GND)
PGND: C1.2 C3.1 C23.1 C31.1 C34.2 C36.1 C38.1 C39.1 C40.1 C45.1 C46.1 C47.1 D7.2(A) H6.1 LED6.1(K) PGND.1 PGND.2 Power.2 Q5.2(E) R0.1 R25.1 R35.1 R38.1 U26.7(PB0) U32.9(EP) U33.6(BTT-) U34.7(PGND)
VBUS: R5.1 R28.1 U32.8(VOUT)
VIN: C36.2 C47.2 D7.1(C) Power.1 U32.1(VIN)
BATTERY: BAT.1 C38.2 L3.2 R33.2 R34.2
BLE_RX: BLE.3 U1.10(PA3)
BLE_TX: BLE.2 U1.9(PA2)
CLK: U1.28(PB4) U29.3
CS: U1.27(PB3) U29.2
CURRENT_IN_ADC: R30.2 TP1.1 U1.17(PB2) U31.4(OUT)
DS3231: DS3231.1 U1.29(PB5)
I2C1_SCL: DS3231.2 U1.19(PA9)
I2C1_SDA: DS3231.3 U1.21(PA10)
INFRARED-RAY: Infrared.3 U1.22(PA11[PA9])
LED: LED1.1(K) U1.23(PA12[PA10])
LIGHT_ADC: Light.3 U1.7(PA0)
MOSI: U1.26(PA15) U29.1
NRST: C7.2 R1.1 SW1.2 U1.6(NRST)
OSC_IN: C6.1 OSC1.3(OUT) U1.2(PC14-OSC32_IN)
POWER: U1.18(PA8)
Power: R36.2
RADER: Radar.1 U1.3(PC15-OSC32_OUT)
RADER_RX: Radar.2 U1.1(PB9)
RADER_TX: Radar.3 U1.12(PA5)
SPI_CS: U1.20(PC6) U26.1(CS#)
SPI_MOSI: U1.11(PA4) U26.3(SI)
SPI_SCK: U1.32(PB8) U26.2(SCK)
SWCLK: R2.2 SWD.3 U1.25(PA14-BOOT0)
SWDIO: SWD.2 U1.24(PA13)
SWITCH1: H6.3 U1.13(PA6)
SWITCH2: H6.4 U1.14(PA7)
SWITCH3: H6.6 U1.15(PB0)
SWITCH4: H6.7 U1.8(PA1)
SWITCH5: H6.9 U1.31(PB7)
SWITCH6: H6.10 U1.30(PB6)
VOLTAGE_OUT_ADC: TP2.1 U1.16(PB1) U30.3(-IN) U30.4(OUT)
$1N3438: LED1.2(A) R3.2
$1N9499: C8.2 C9.2 R32.1 U1.4(VDD/VDDA)
$3N2637: C23.2 C31.2 D11.1(K) F1.1 R14.2
$3N2640: R14.1 U26.5(PA0)
$3N11326: R24.2 R26.1
$3N12856: C34.1 R24.1 R25.2 U30.1(+IN)
$3N14639: R29.2 R30.1 U31.3(-IN)
$3N14774: R28.2 R31.2 U31.1(+IN)
$3N19545: L3.1 U32.7(SW)
$3N19735: U33.2(DO) U33.4(G1)
$3N19736: BAT.2 C41.1 U33.3(GND)
$3N19737: U33.5(G2) U33.8(OC)
$3N19739: C41.2 R34.1 U33.7(VDD)
$3N19740: R35.2 U33.1(V-)
$3N23149: Q5.1(B) R36.1
$3N23156: Q5.3(C) R37.1 U34.10(SYNC/SHDN#)
$3N23384: C42.2 U34.4(REF)
$3N23532: R39.1 U34.2(FREQ)
$3N23544: C44.2 U34.1(LDO)
$3N23743: Q4.1(S) Q4.2(S) Q4.3(S) R38.2 U34.6(CS+)
$3N23755: Q4.4(G) U34.8(EXT)
$3N23799: Q4.5(D) Q4.6(D) Q4.7(D) Q4.8(D) T1.2 T1.4
$3N23862: D11.2(A) T1.3
$3N23904: C43.2 U26.6(PW0) U34.5(FB)
$3N25392: R40.1 U32.2(LED1)
$3N25397: LED6.2(A) R40.2
$3N25796: C39.2 C40.2 R33.1 R41.1 U32.6(BAT)
$3N27137: R41.2 U32.3(LED2) U32.4(LED3)

Not connected (* = marked no-connect by the designer): H6 5* 8*; OSC1 1(Tri-state)*; U32 5(KEY)*

## Notes on the sheets
sheet 1
- 降压
- 晶振电路
- MCU主控
- 电源部分
- 保护电路
- 复位电路
- 毫米波雷达
- 红外接收
- SWD下载电路
- DS3231
- 蓝牙
- 环境光传感器
sheet 2
- 电压电流采样
- 充电电路
- 过充过放保护电路
- 输入采样
- 170V输出采样
